# Altium schematic sheet MP2329GG_EVB.SchDoc
size A3
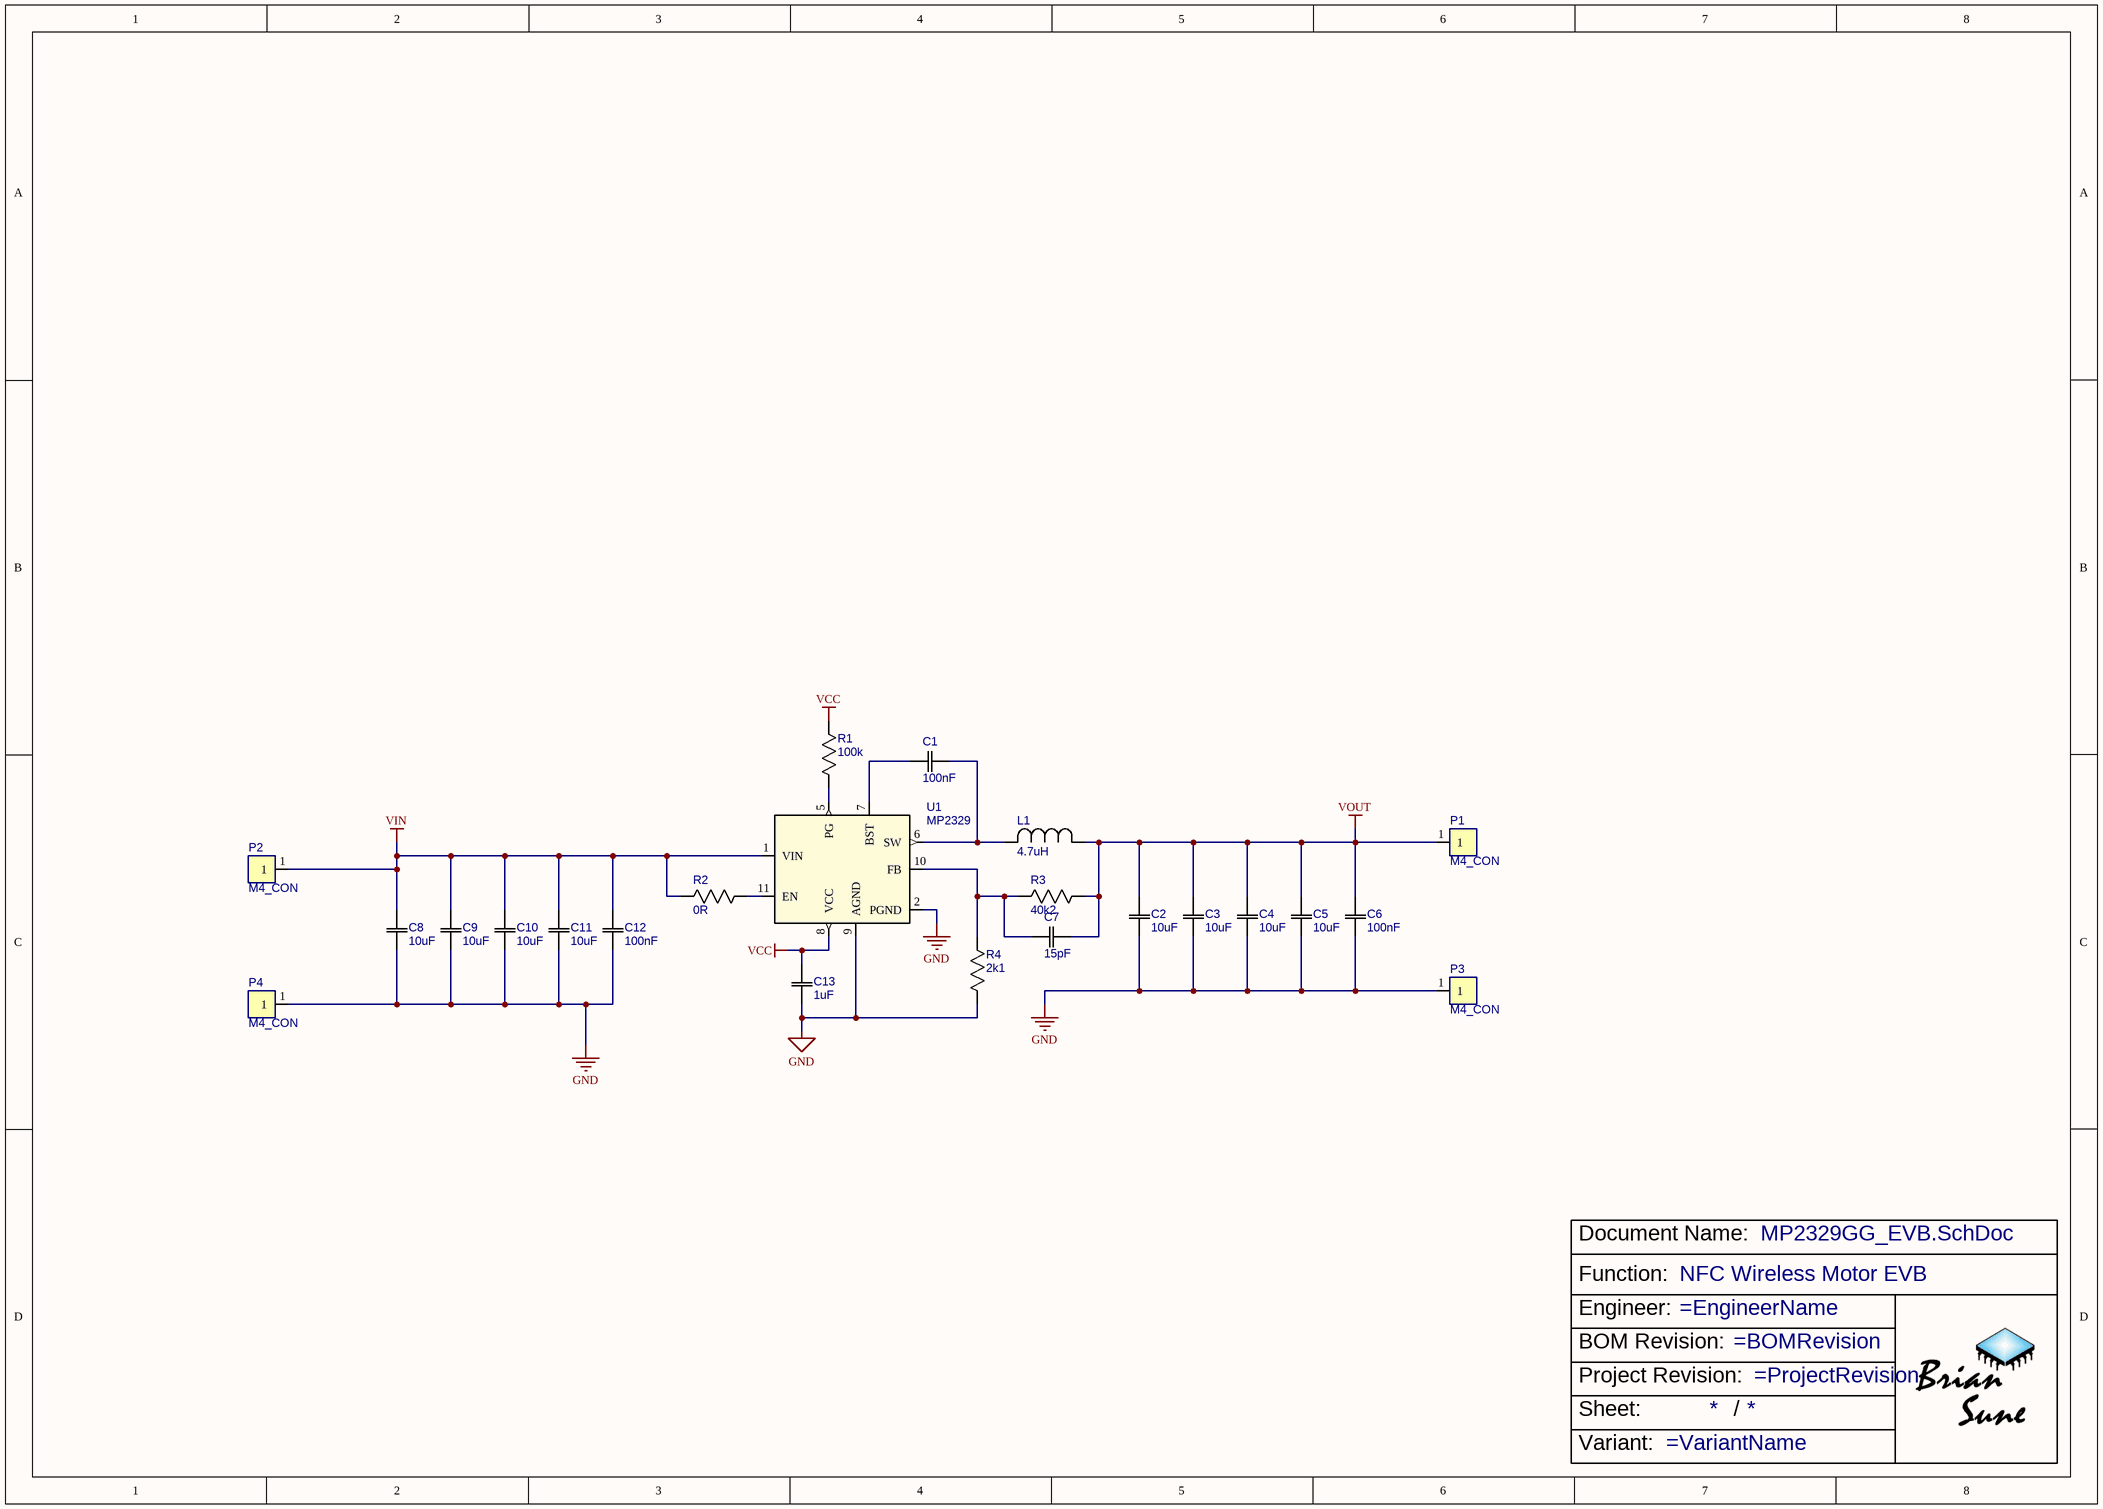
[diagram p0: MP2329GG_EVB.SchDoc]

## Parts
?  Function: NFC Wireless Motor EVB  (hidden comment: TitleBlock)  (graphical)
C1  100nF  [0402]
C2  10uF  [C0603]
C3  10uF  [C0603]
C4  10uF  [C0603]
C5  10uF  [C0603]
C6  100nF  [C0603]
C7  15pF  [0402]
C8  10uF  [C0603]
C9  10uF  [C0603]
C10  10uF  [C0603]
C11  10uF  [C0603]
C12  100nF  [C0603]
C13  1uF  [0402]
L1  4.7uH  [0650SMD]
P1  M4_CON  [PCBComponent_1]
P2  M4_CON  [PCBComponent_1]
P3  M4_CON  [PCBComponent_1]
P4  M4_CON  [PCBComponent_1]
R1  100k  [0402]
R2  0R  [0402]
R3  40k2  [0402]
R4  2k1  [0402]
U1  MP2329  [QFN2x2]

## Nets
GND: C2.1 C3.1 C4.1 C5.1 C6.1 C8.1 C9.1 C10.1 C11.1 C12.1 C13.1 P3.1 P4.1 R4.2 U1.2(PGND) U1.9(AGND)
VCC: C13.2 R1.2 U1.8(VCC)
VIN: C8.2 C9.2 C10.2 C11.2 C12.2 P2.1 R2.1 U1.1(VIN)
VOUT: C2.2 C3.2 C4.2 C5.2 C6.2 C7.2 L1.1 P1.1 R3.1
NetC1_1: C1.1 U1.7(BST)
NetC1_2: C1.2 L1.2 U1.6(SW)
NetC7_1: C7.1 R3.2 R4.1 U1.10(FB)
NetR1_1: R1.1 U1.5(PG)
NetR2_2: R2.2 U1.11(EN)

## Notes on the sheet
- (in symbol TitleBlock) Document Name:; Function:; Engineer:; BOM Revision:; Project Revision:; Sheet:; /; Variant:

## Library data of the parts
C1 = OBEIDUN_100nF: 0402 100NF 104K  50V X7R; ComponentLink1Description: taobao; ComponentLink1URL: https://detail.tmall.com/item.htm?abbucket=11&id=610169377419&rn=af8cc3c313be083494688299e412f071&skuId=4460562122099&spm=a1z10.3-b.w4011-22147617817.47.43b27d1eVfSLTc; Mfr.: OBEIDUN; Mfr. No: 104K; Price: 0.03
C2-C5 C8-C11 = OUDEIBUN_10uF_25V: OUDEIBUN / 25V 10% 106K X5R; Mfr. No: 106; ComponentLink1Description: taobao; ComponentLink1URL: https://detail.tmall.com/item.htm?abbucket=11&id=610884231672&rn=bfecce7903ee26d41e055cbdf2d2e6eb&skuId=4463564134688&spm=a1z10.3-b.w4011-22147617817.28.ed547d1efUUngR; Mfr.: OUDEIBUN; Price: 0.1
C6 C12 = OUDEIBUN_100nF: 0603 100NF 50V 10% 104K X7R; ComponentLink1Description: taobao; ComponentLink1URL: https://detail.tmall.com/item.htm?_u=p10quk0k2f35&id=610651934672&spm=a1z09.2.0.0.77b12e8d9iVia0&skuId=4463522550238; Mfr.: OUDEIBUN; Mfr. No: 104K; Price: 0.025
C7 = OBEIDUN_15PF: 0402 15PF 50V 150J COG NPO; ComponentLink1Description: taobao; ComponentLink1URL: https://detail.tmall.com/item.htm?abbucket=11&id=609566086851&rn=9c23be302cc76959a38b5b2aeca1aa2d&spm=a1z10.3-b.w4011-22147617817.45.7cb37d1eI3FZvy&skuId=4450905106486; Mfr.: OBEIDUN; Mfr. No: 150J; Price: 0.02
C13 = OBEIDUN_1uF_10V: 0402 1uF 105K  10V X5R; ComponentLink1Description: taobao; ComponentLink1URL: https://detail.tmall.com/item.htm?abbucket=11&id=610172645232&rn=f8e73e5cbdb7eccb6b86c37cd9a91747&skuId=4460600150247&spm=a1z10.3-b.w4011-22147617817.50.46817d1eu0mbEn; Mfr.: OBEIDUN; Mfr. No: 105K; Price: 0.025
L1 = L0650: 6mmx5mm (LxH) DCDC Inductor SMD; Mfr.: Your Cee; Mfr. No: 0650_2R2; ComponentLink1Description: taobao; ComponentLink1URL: https://item.taobao.com/item.htm?spm=a1z10.5-c-s.w4002-24706531925.25.3c7641b1SqlSXT&id=618284197303; Price: 0.50
P1-P4 = M4_CON: Mfr.: LFX; Mfr. No: PCB-10-4; ComponentLink1Description: taobao; ComponentLink1URL: https://item.taobao.com/item.htm?spm=a1z09.2.0.0.45712e8dxvwLo5&id=531030902005&_u=s10quk0k994a; Price: 0.41
R1 = OUDEIBUN_100k: OUDEIBUN / 1% 100k; Mfr.: UNIOHM; ComponentLink1Description: taobao; ComponentLink1URL: https://detail.tmall.com/item.htm?abbucket=11&id=608928061564&rn=6cabffb4bef601fc6d0198b0cb480a08&spm=a1z10.3-b.w4011-22147617817.51.20d47d1eFEZrXW&skuId=4280827589222; Mfr. No: 100k; Price: 0.02
R2 = OUDEIBUN_0R: OUDEIBUN / 0R 1% 1/16W; ComponentLink1Description: taobao; ComponentLink1URL: https://detail.tmall.com/item.htm?abbucket=11&id=609078082053&rn=dd22835191e181ef543cf6f0827e8de3&spm=a1z10.3-b.w4011-22147617817.40.1e787d1eBkSpf5&skuId=4447040574382; Mfr.: OUDEIBUN; Mfr. No: 0R; Price: 0.02
R3 = UNIOHM_40k2: UNIOHM / 40k2 1% 1/16W; ComponentLink1Description: taobao; ComponentLink1URL: https://item.taobao.com/item.htm?spm=a1z10.3-c-s.w4002-24706531953.9.4cff6a4bFcr7uh&id=525646732568; Mfr.: UNIOHM; Mfr. No: 40k2; Price: 0.012
R4 = OUDEIBUN_1k5: OUDEIBUN / 1% 1k5; ComponentLink1Description: taobao; ComponentLink1URL: https://detail.tmall.com/item.htm?abbucket=11&id=609080898470&rn=e8ac5f428b57ca8c5f4fd2285344b596&spm=a1z10.3-b.w4011-22147617817.56.4da07d1eK35JhM&skuId=4276063084040; Mfr.: OUDEIBUN; Mfr. No: 1k5; Price: 0.02
U1 = MP2329: 24V, 6.5A, Low IQ, Synchronous, Buck Converter; Mfr.: Monolithic Power Systems; Mfr. No: MP2329; Price: 1.8; ComponentLink1Description: taobao; ComponentLink1URL: https://detail.tmall.com/item.htm?spm=a1z0d.6639537/tb.1997196601.4.78517484v1qEmf&id=680225556463